# EAGLE schematic ATtiny85_Learn2 (EAGLE 6.5.0)
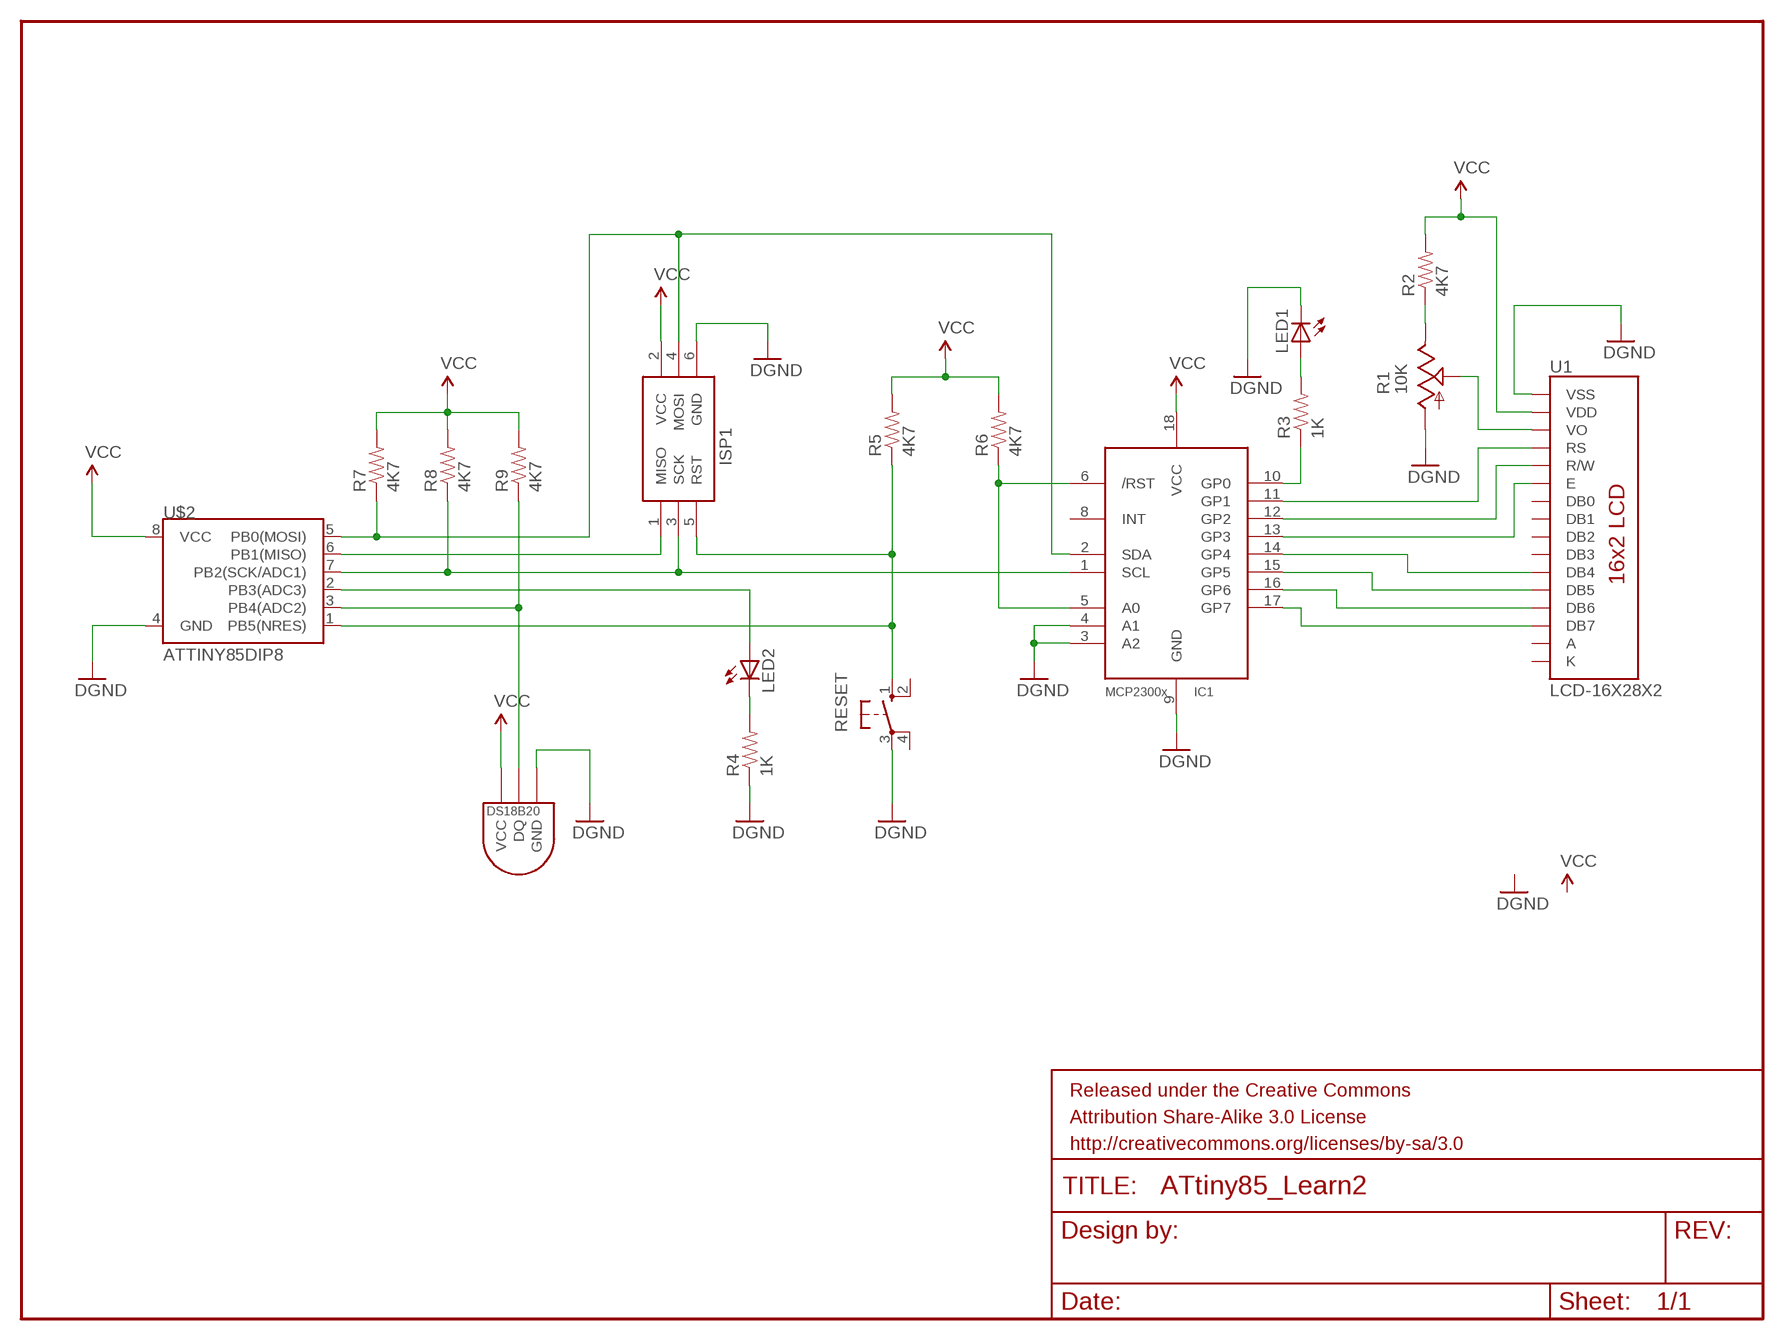
[diagram p0: schematic, sheet 1]

## Parts
IC1  MCP2300X/P  [DIL18]
ISP1  AVRISP-6  [AVRISP]
LED1  LED5MM  [LED5MM]
LED2  LED5MM  [LED5MM]
R1  10K  TRIM_US-CA6V  [CA6V]
R2  4K7  RESISTORAXIAL-0.3  [AXIAL-0.3]
R3  1K  RESISTORAXIAL-0.3  [AXIAL-0.3]
R4  1K  RESISTORAXIAL-0.3  [AXIAL-0.3]
R5  4K7  RESISTORAXIAL-0.3  [AXIAL-0.3]
R6  4K7  RESISTORAXIAL-0.3  [AXIAL-0.3]
R7  4K7  RESISTORAXIAL-0.3  [AXIAL-0.3]
R8  4K7  RESISTORAXIAL-0.3  [AXIAL-0.3]
R9  4K7  RESISTORAXIAL-0.3  [AXIAL-0.3]
RESET  10-XX  [B3F-10XX]
U1  LCD-16X28X2  [LCD-8X2]
U$1  DS1820TO92  [DS1820]
U$2  ATTINY85DIP8  ATTINY45DIP8  [DIP08]

## Nets
GND: IC1.3(A2) IC1.4(A1) IC1.9(GND) ISP1.6(GND) LED1.K(C) R1.A R4.P$1 RESET.3(P) U1.1(VSS) U$1.GND U$2.4(GND) ; supply symbol labelled DGND
N$1: IC1.17(GP7) U1.14(DB7)
N$2: IC1.16(GP6) U1.13(DB6)
N$3: IC1.15(GP5) U1.12(DB5)
N$4: IC1.14(GP4) U1.11(DB4)
N$5: IC1.13(GP3) U1.6(E)
N$6: IC1.12(GP2) U1.5(R/W)
N$7: IC1.11(GP1) U1.4(RS)
N$8: R1.S U1.3(VO)
N$9: R1.E R2.P$1
N$10: IC1.10(GP0) R3.P$1
N$11: LED1.A R3.P$2
N$12: ISP1.1(MISO) U$2.6(PB1(MISO))
N$13: IC1.2(SDA) ISP1.4(MOSI) R7.P$1 U$2.5(PB0(MOSI))
N$14: LED2.A U$2.2(PB3(ADC3))
N$15: R9.P$1 U$1.DQ U$2.3(PB4(ADC2))
N$16: IC1.1(SCL) ISP1.3(SCK) R8.P$1 U$2.7(PB2(SCK/ADC1))
N$17: LED2.K(C) R4.P$2
N$18: ISP1.5(RST) R5.P$1 RESET.1(S) U$2.1(PB5(NRES))
N$19: IC1.5(A0) IC1.6(/RST) R6.P$1
VCC: IC1.18(VCC) ISP1.2(VCC) R2.P$2 R5.P$2 R6.P$2 R7.P$2 R8.P$2 R9.P$2 U1.2(VDD) U$1.VDD(VCC) U$2.8(VCC)
Unconnected: IC1.8(INT) RESET.2(S1) RESET.4(P1) U1.7(DB0) U1.8(DB1) U1.9(DB2) U1.10(DB3)

## Power pins joined to a net without a drawn wire
A: U1.15(A)
K: U1.16(K)

## Library data of the parts
IC1 = adafruit:MCP2300X: MCP23008 Inexpensive i2c i/o expander - 8 general purpose i/o pins with optional pullups
ISP1 = adafruit:AVRISP: AVR ISP HEADER Standard 6 pin header for AVR programming
LED1 LED2 = adafruit:LED: LED OSRAM: - CHIPLED LG R971, LG N971, LY N971, LG Q971, LY Q971, LO R971, LY R971 LH N974, LH R974 LS Q976, LO Q976, LY Q976 LO Q996 - Hyper CHIPLED LW Q18S LB Q993, LB Q99A, LB R99A - SideLED LS A670, LO A670, LY A670, LG A670, LP A670 LB A673, LV A673, LT A673, LW A673 LH A674 LY A675 LS A676, LA A676, LO A676, LY A676, LW A676 LS A679, LY A679, LG A679 - Hyper Micro SIDELED® LS Y876, LA Y876, LO Y876, LY Y876 LT Y87S - SmartLED LW L88C, LW L88S LB L89C, LB L89S, LG L890 LS L89K, LO L89K, LY L89K LS L896, LA L896, LO L896, LY L896 - TOPLED LS T670, LO T670, LY T670, LG T670, LP T670 LSG T670, LSP T670, LSY T670, LOP T670, LYG T670 LG T671, LOG T671, LSG T671 LB T673, LV T673, LT T673, LW T673 LH T674 LS T676, LA T676, LO T676, LY T676, LB T676, LH T676, LSB T676, LW T676 LB T67C, LV T67C, LT T67C, LS T67K, LO T67K, LY T67K, LW E67C LS E67B, LA E67B, LO E67B, LY E67B, LB E67C, LV E67C, LT E67C LW T67C LS T679, LY T679, LG T679 LS T770, LO T770, LY T770, LG T770, LP T770 LB T773, LV T773, LT T773, LW T773 LH T774 LS E675, LA E675, LY E675, LS T675 LS T776, LA T776, LO T776, LY T776, LB T776 LHGB T686 LT T68C, LB T68C - Hyper Mini TOPLED® LB M676 - Mini TOPLED Santana® LG M470 LS M47K, LO M47K, LY M47K Source: http://www.osram.convergy.de/
R1 = pot:TRIM_US-: POTENTIOMETER
R2-R9 = SparkFun-Passives:RESISTOR: Resistor Basic schematic elements and footprints for 0603, 1206, and PTH resistors.
RESET = switch-omron:10-XX: OMRON SWITCH; MPN: B3F-1000; OC_FARNELL: 176432; OC_NEWARK: 36M3542
U1 = SparkFun-Displays:LCD-16X2: Standard text-only 16x2 parallel input LCD
U$1 = Ava:DS1820: DS18B20 Programmable Resolution 1-Wire Digital Thermometer Description The DS18B20 digital thermometer provides 9-bit to 12-bit Celsius temperature measurements and has an alarm function with nonvolatile user-programmable upper and lower trigger points. The DS18B20 communicates over a 1-Wire® bus that by definition requires only one data line (and ground) for communication with a central microprocessor. It has an operating temperature range of -55°C to +125°C and is accurate to ±0.5°C over the range of -10°C to +85°C. In addition, the DS18B20 can derive power directly from the data line ("parasite power"), eliminating the need for an external power supply. Each DS18B20 has a unique 64-bit serial code, which allows multiple DS18B20s to function on the same 1-Wire bus. Thus, it is simple to use one microprocessor to control many DS18B20s distributed over a large area. Applications that can benefit from this feature include HVAC environmental controls, temperature monitoring systems inside buildings, equipment, or machinery, and process monitoring and control systems.
U$2 = SparkFun-DigitalIC:ATTINY45: Atmel 8-pin 2/4/8kB flash uC